# EAGLE design Eurorack_breadboard_PSU_ad (EAGLE 7.1.0)
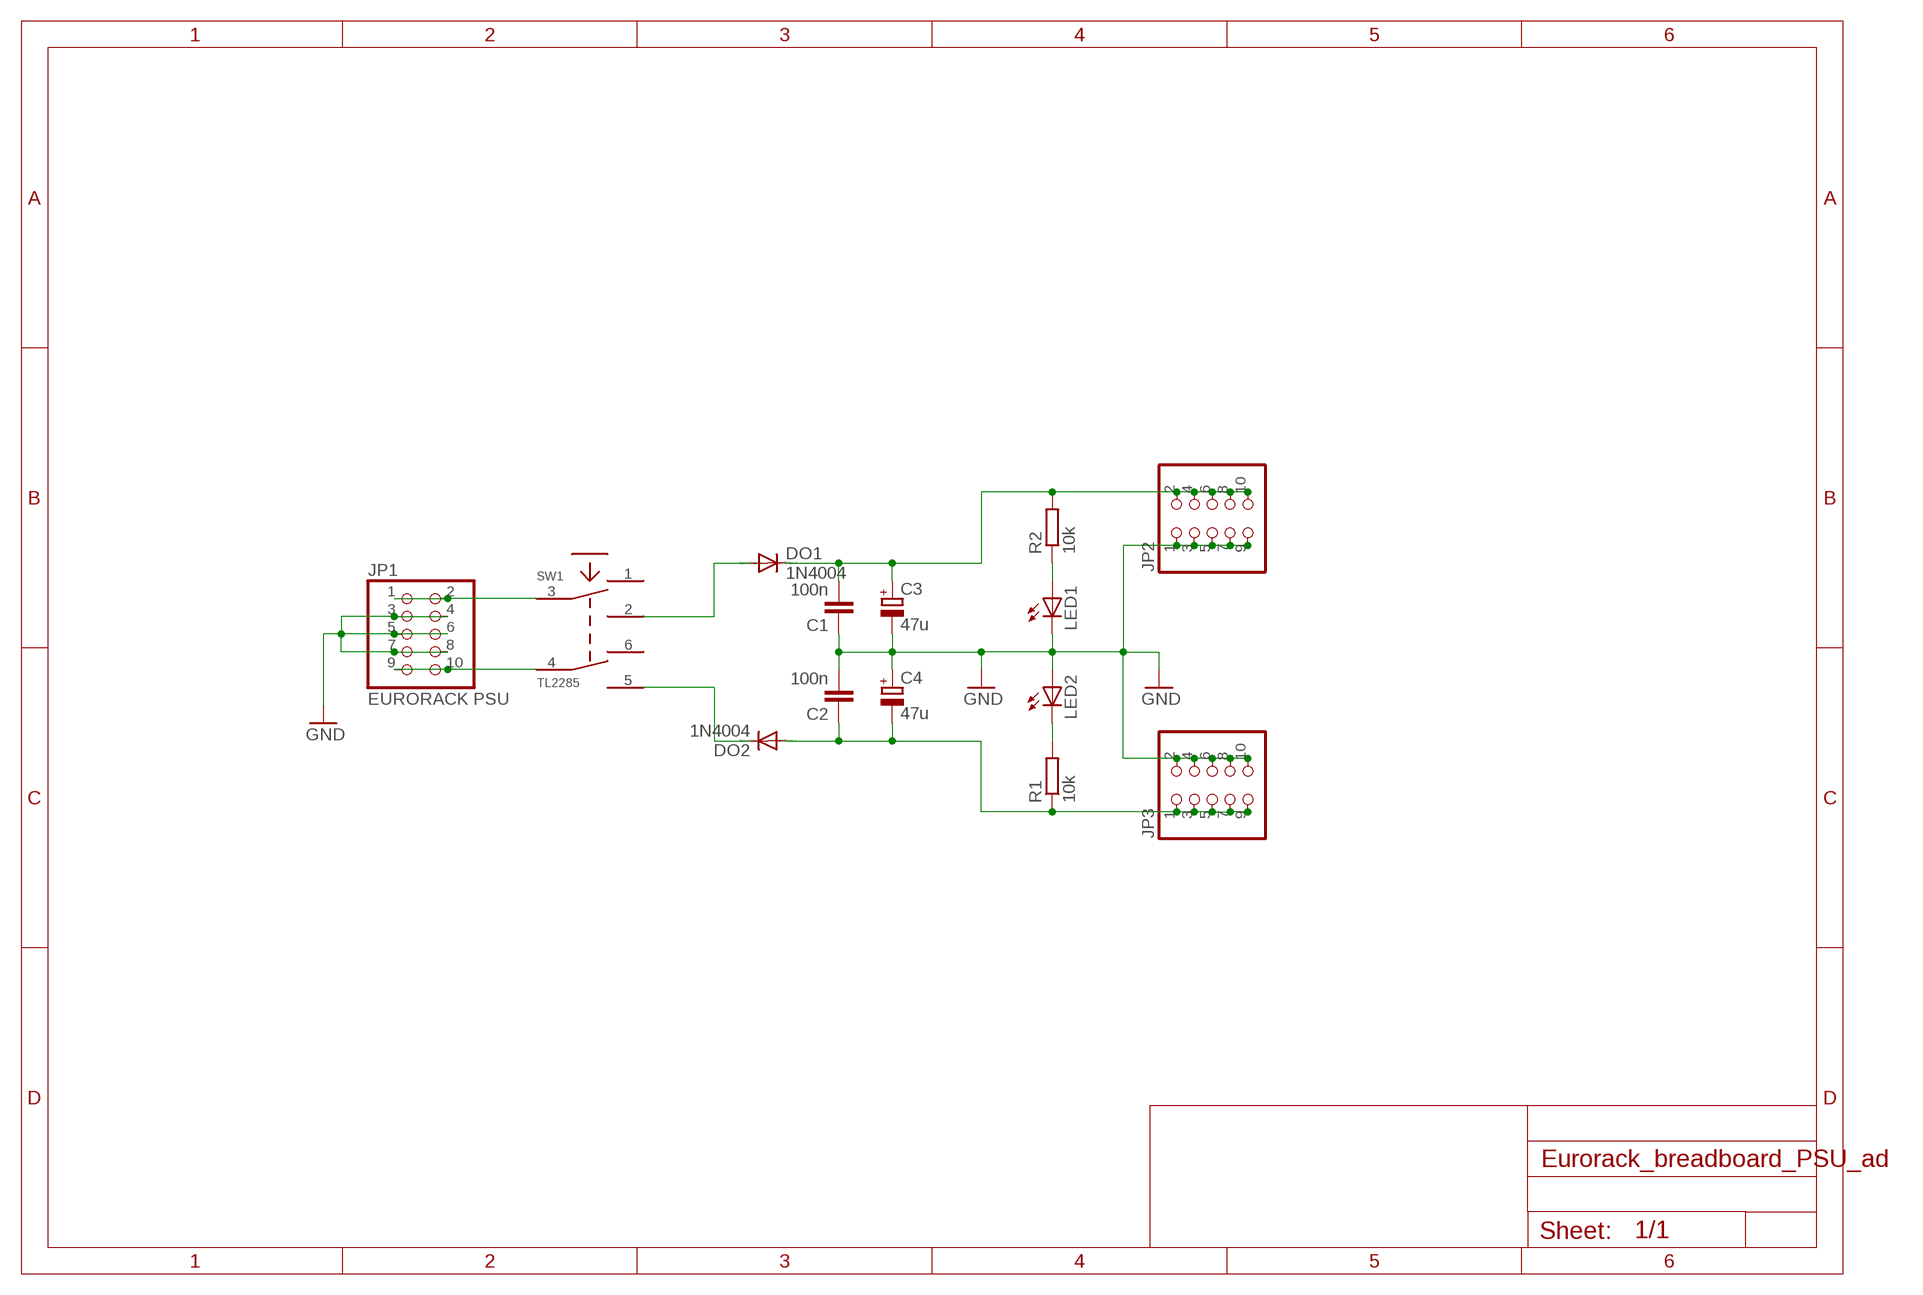
[diagram p0: schematic, sheet 1]

## Parts
C1  100n  C-EU025-025X050  [C025-025X050]
C2  100n  C-EU025-025X050  [C025-025X050]
C3  47u  CPOL-EUE2.5-5  [E2,5-5]
C4  47u  CPOL-EUE2.5-5  [E2,5-5]
DO1  1N4004  1N4004SMALL  [DO41-7]
DO2  1N4004  1N4004SMALL  [DO41-7]
JP1  EURORACK PSU  PINHD-2X5  [2X05]
JP2  PINHD-2X5  [2X05]
JP3  PINHD-2X5  [2X05]
LED1  LED3MM  [LED3MM]
LED2  LED3MM  [LED3MM]
R1  10k  R-EU_0207/2V  [0207/2V]
R2  10k  R-EU_0207/2V  [0207/2V]
SW1  TL2285  [TL2285_PCB]

## Nets
GND: C1.1 C2.2 C3.- C4.+ JP1.3 JP1.4 JP1.5 JP1.6 JP1.7 JP1.8 JP2.1 JP2.3 JP2.5 JP2.7 JP2.9 JP3.2 JP3.4 JP3.6 JP3.8 JP3.10 LED1.K(C) LED2.A
N$1: LED1.A R2.1
N$2: DO2.C SW1.5
N$3: DO1.A SW1.2
N$4: LED2.K(C) R1.2
N$5: JP1.1 JP1.2 SW1.3
N$6: JP1.9 JP1.10 SW1.4
N$10: C2.1 C4.- DO2.A JP3.1 JP3.3 JP3.5 JP3.7 JP3.9 R1.1
N$11: C1.2 C3.+ DO1.C JP2.2 JP2.4 JP2.6 JP2.8 JP2.10 R2.2
Unconnected: SW1.1 SW1.6

## Library data of the parts
C1 C2 = rcl:C-EU: CAPACITOR, European symbol
C3 C4 = rcl:CPOL-EU: POLARIZED CAPACITOR, European symbol
DO1 DO2 = lb_devs:1N4004: 1N4004 diode compact layout general purpose rectifier, 1 A
JP1-JP3 = pinhead:PINHD-2X5: PIN HEADER
LED1 LED2 = led:LED: LED OSRAM: - CHIPLED LG R971, LG N971, LY N971, LG Q971, LY Q971, LO R971, LY R971 LH N974, LH R974 LS Q976, LO Q976, LY Q976 LO Q996 - Hyper CHIPLED LW Q18S LB Q993, LB Q99A, LB R99A - SideLED LS A670, LO A670, LY A670, LG A670, LP A670 LB A673, LV A673, LT A673, LW A673 LH A674 LY A675 LS A676, LA A676, LO A676, LY A676, LW A676 LS A679, LY A679, LG A679 - Hyper Micro SIDELED® LS Y876, LA Y876, LO Y876, LY Y876 LT Y87S - SmartLED LW L88C, LW L88S LB L89C, LB L89S, LG L890 LS L89K, LO L89K, LY L89K LS L896, LA L896, LO L896, LY L896 - TOPLED LS T670, LO T670, LY T670, LG T670, LP T670 LSG T670, LSP T670, LSY T670, LOP T670, LYG T670 LG T671, LOG T671, LSG T671 LB T673, LV T673, LT T673, LW T673 LH T674 LS T676, LA T676, LO T676, LY T676, LB T676, LH T676, LSB T676, LW T676 LB T67C, LV T67C, LT T67C, LS T67K, LO T67K, LY T67K, LW E67C LS E67B, LA E67B, LO E67B, LY E67B, LB E67C, LV E67C, LT E67C LW T67C LS T679, LY T679, LG T679 LS T770, LO T770, LY T770, LG T770, LP T770 LB T773, LV T773, LT T773, LW T773 LH T774 LS E675, LA E675, LY E675, LS T675 LS T776, LA T776, LO T776, LY T776, LB T776 LHGB T686 LT T68C, LB T68C - Hyper Mini TOPLED® LB M676 - Mini TOPLED Santana® LG M470 LS M47K, LO M47K, LY M47K Source: http://www.osram.convergy.de LUXEON: - LUMILED® LXK2-PW12-R00, LXK2-PW12-S00, LXK2-PW14-U00, LXK2-PW14-V00 LXK2-PM12-R00, LXK2-PM12-S00, LXK2-PM14-U00 LXK2-PE12-Q00, LXK2-PE12-R00, LXK2-PE12-S00, LXK2-PE14-T00, LXK2-PE14-U00 LXK2-PB12-K00, LXK2-PB12-L00, LXK2-PB12-M00, LXK2-PB14-N00, LXK2-PB14-P00, LXK2-PB14-Q00 LXK2-PR12-L00, LXK2-PR12-M00, LXK2-PR14-Q00, LXK2-PR14-R00 LXK2-PD12-Q00, LXK2-PD12-R00, LXK2-PD12-S00 LXK2-PH12-R00, LXK2-PH12-S00 LXK2-PL12-P00, LXK2-PL12-Q00, LXK2-PL12-R00 Source: www.luxeon.com KINGBRIGHT: KA-3528ASYC Source: www.kingbright.com
R1 R2 = rcl:R-EU_: RESISTOR, European symbol
SW1 = lb_devs:TL2285: E-Switch TL2285 (PCB switch)

## Board
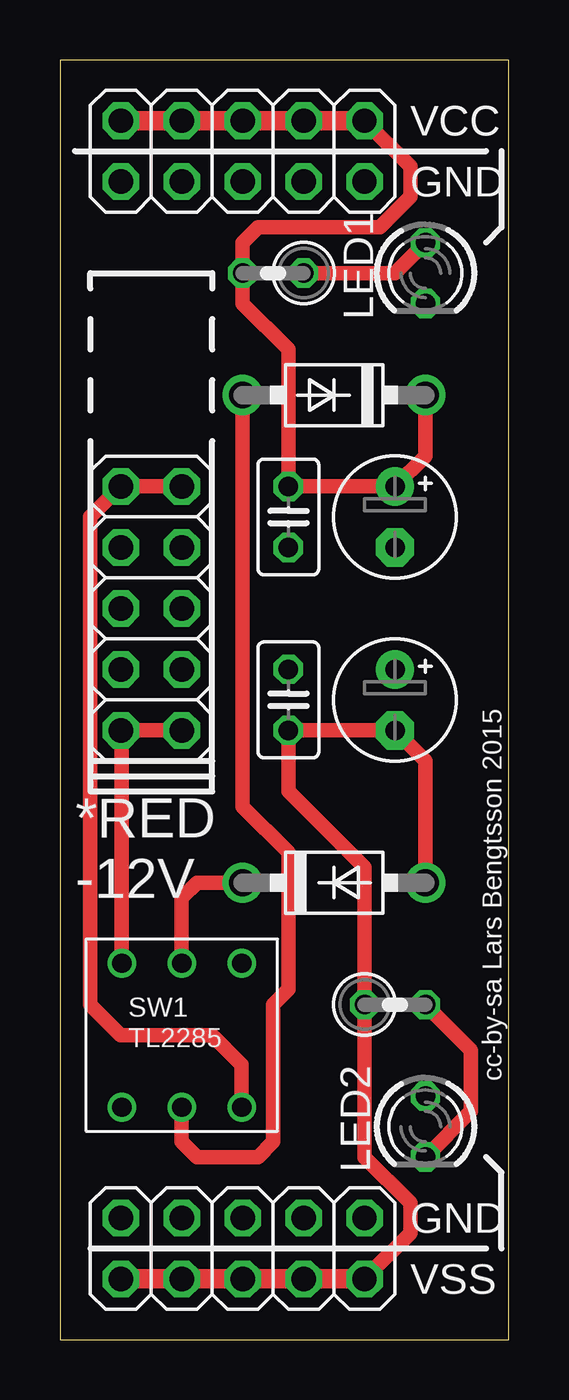
[diagram p1: board, top side]
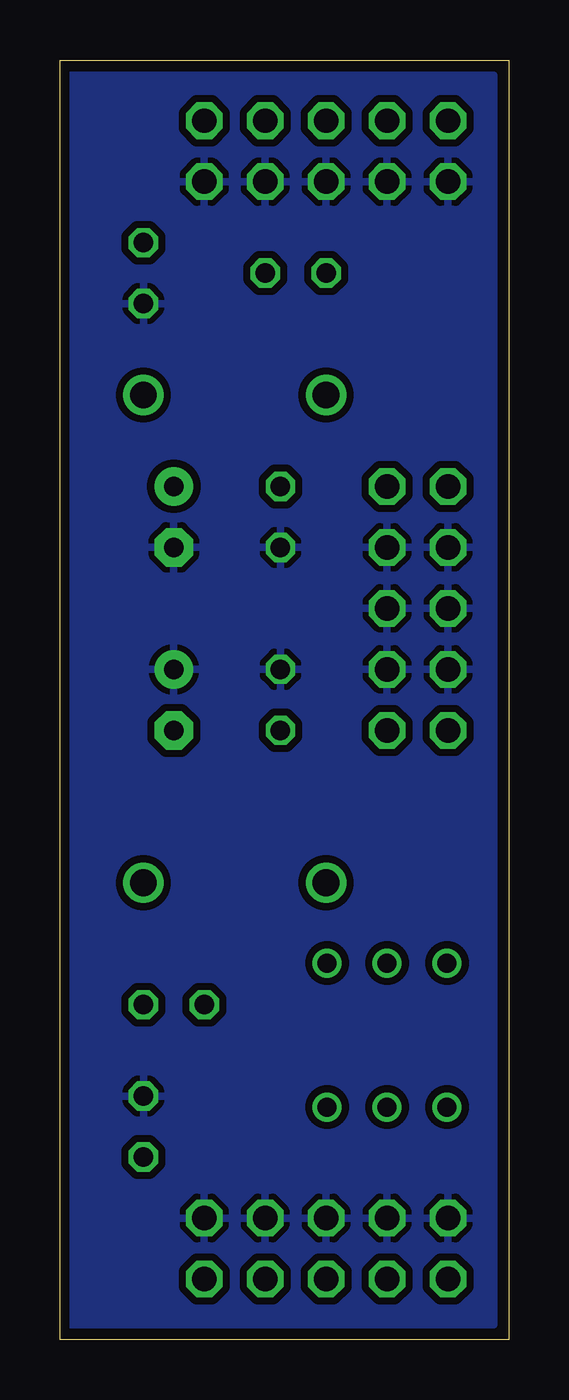
[diagram p2: board, bottom side, seen from below]

Size 18.72 x 53.33 mm. Coordinates in mm from the lower left corner, seen from the top.
Outline: 0,0 18.72,0 18.72,53.33 0,53.33 0,0
Copper layers (1*16): Top 0.0356mm / dielectric 1.5011mm / Bottom 0.0356mm
Design rules "LaenPCBOrder": minimum track width 6mil, minimum drill 13mil, track to track 6mil, track to pad 6mil, pad to pad 6mil, via to via 6mil, smd to smd 6mil, copper to edge 15mil, drill to drill 6mil, minimum pad ring 7mil, minimum via ring 7mil, stop-mask expansion 3mil, vias tented up to drill 0mil, thermal gap 10mil

### Footprints (pad centres in the part's own frame; a part is rotated, then mirrored left to right if it is on the bottom)
C025-025X050 = drill 0.813 octagon: 1 -1.27,0; 2 1.27,0
E2,5-5 = drill 0.813 pad 1.6: + -1.27,0 | drill 0.813 pad 1.6 octagon: - 1.27,0
DO41-7 = drill 1.118: A 3.81,0; C -3.81,0
2X05 = drill 1.016 octagon: 1 -5.08,-1.27; 2 -5.08,1.27; 3 -2.54,-1.27; 4 -2.54,1.27; 5 0,-1.27; 6 0,1.27; 7 2.54,-1.27; 8 2.54,1.27; 9 5.08,-1.27; 10 5.08,1.27
LED3MM = drill 0.813 octagon: A -1.27,0; K 1.27,0
0207/2V = drill 0.813 octagon: 1 -1.27,0; 2 1.27,0
TL2285_PCB = drill 0.8: 1 -2.5,-3; 2 0,-3; 3 2.5,-3; 4 -2.5,3; 5 0,3; 6 2.5,3

### Placement (x,y rotation side)
C1  9.53,34.29 90 top
C2  9.53,26.67 90 top
C3  13.97,34.29 270 top
C4  13.97,26.67 270 top
DO1  11.43,39.37 180 top
DO2  11.43,19.05 0 top
JP1  3.81,30.48 270 top
JP2  7.62,49.53 0 top
JP3  7.62,3.81 0 top
LED1  15.24,44.45 270 top
LED2  15.24,8.89 270 top
R1  13.97,13.97 0 top
R2  8.89,44.45 180 top
SW1  5.08,12.7 0 top

### Tracks (layer width: path | path; a pad name or v marks a point on that pad's centre or on a via)
GND
  pour Bottom (isolate 0.305): 0.64,52.7 0.64,0.64 18.41,0.64 18.41,52.7
N$1
  Top 0.61: R2.1 13.97,44.45 LED1.A
N$2
  Top 0.61: SW1.5 5.08,18.41 5.71,19.05 DO2.C
N$3
  Top 0.61: SW1.2 5.08,8.26 5.71,7.62 8.26,7.62 8.89,8.26 8.89,13.97 9.53,14.61 9.53,20.32 7.62,22.23 DO1.A
N$4
  Top 0.61: R1.2 17.14,12.06 17.14,9.53 LED2.K
N$5
  Top 0.61: JP1.2 JP1.1 1.27,34.29 1.27,13.97 2.54,12.7 6.35,12.7 7.58,11.47 SW1.3
N$6
  Top 0.61: JP1.10 JP1.9 2.58,25.36 SW1.4
N$10
  Top 0.61: DO2.A 15.24,24.13 C4.- C2.1 9.53,22.86 12.7,19.68 R1.1 12.7,7.62 14.61,5.71 14.61,4.45 JP3.9
  Top 0.813: JP3.1 JP3.3 JP3.5 JP3.7 JP3.9
N$11
  Top 0.61: DO1.C 15.24,36.83 C3.+ C1.2 9.53,41.27 7.62,43.18 R2.2 7.62,45.72 8.26,46.35 13.34,46.35 14.61,47.62 14.61,48.9 JP2.10
  Top 0.813: JP2.2 JP2.4 JP2.6 JP2.8 JP2.10

### Text on the board
tNames: VCC | GND | *RED / -12V | cc-by-sa Lars Bengtsson 2015 | GND | VSS